# Altium schematic sheet board_schematic.SchDoc
size B
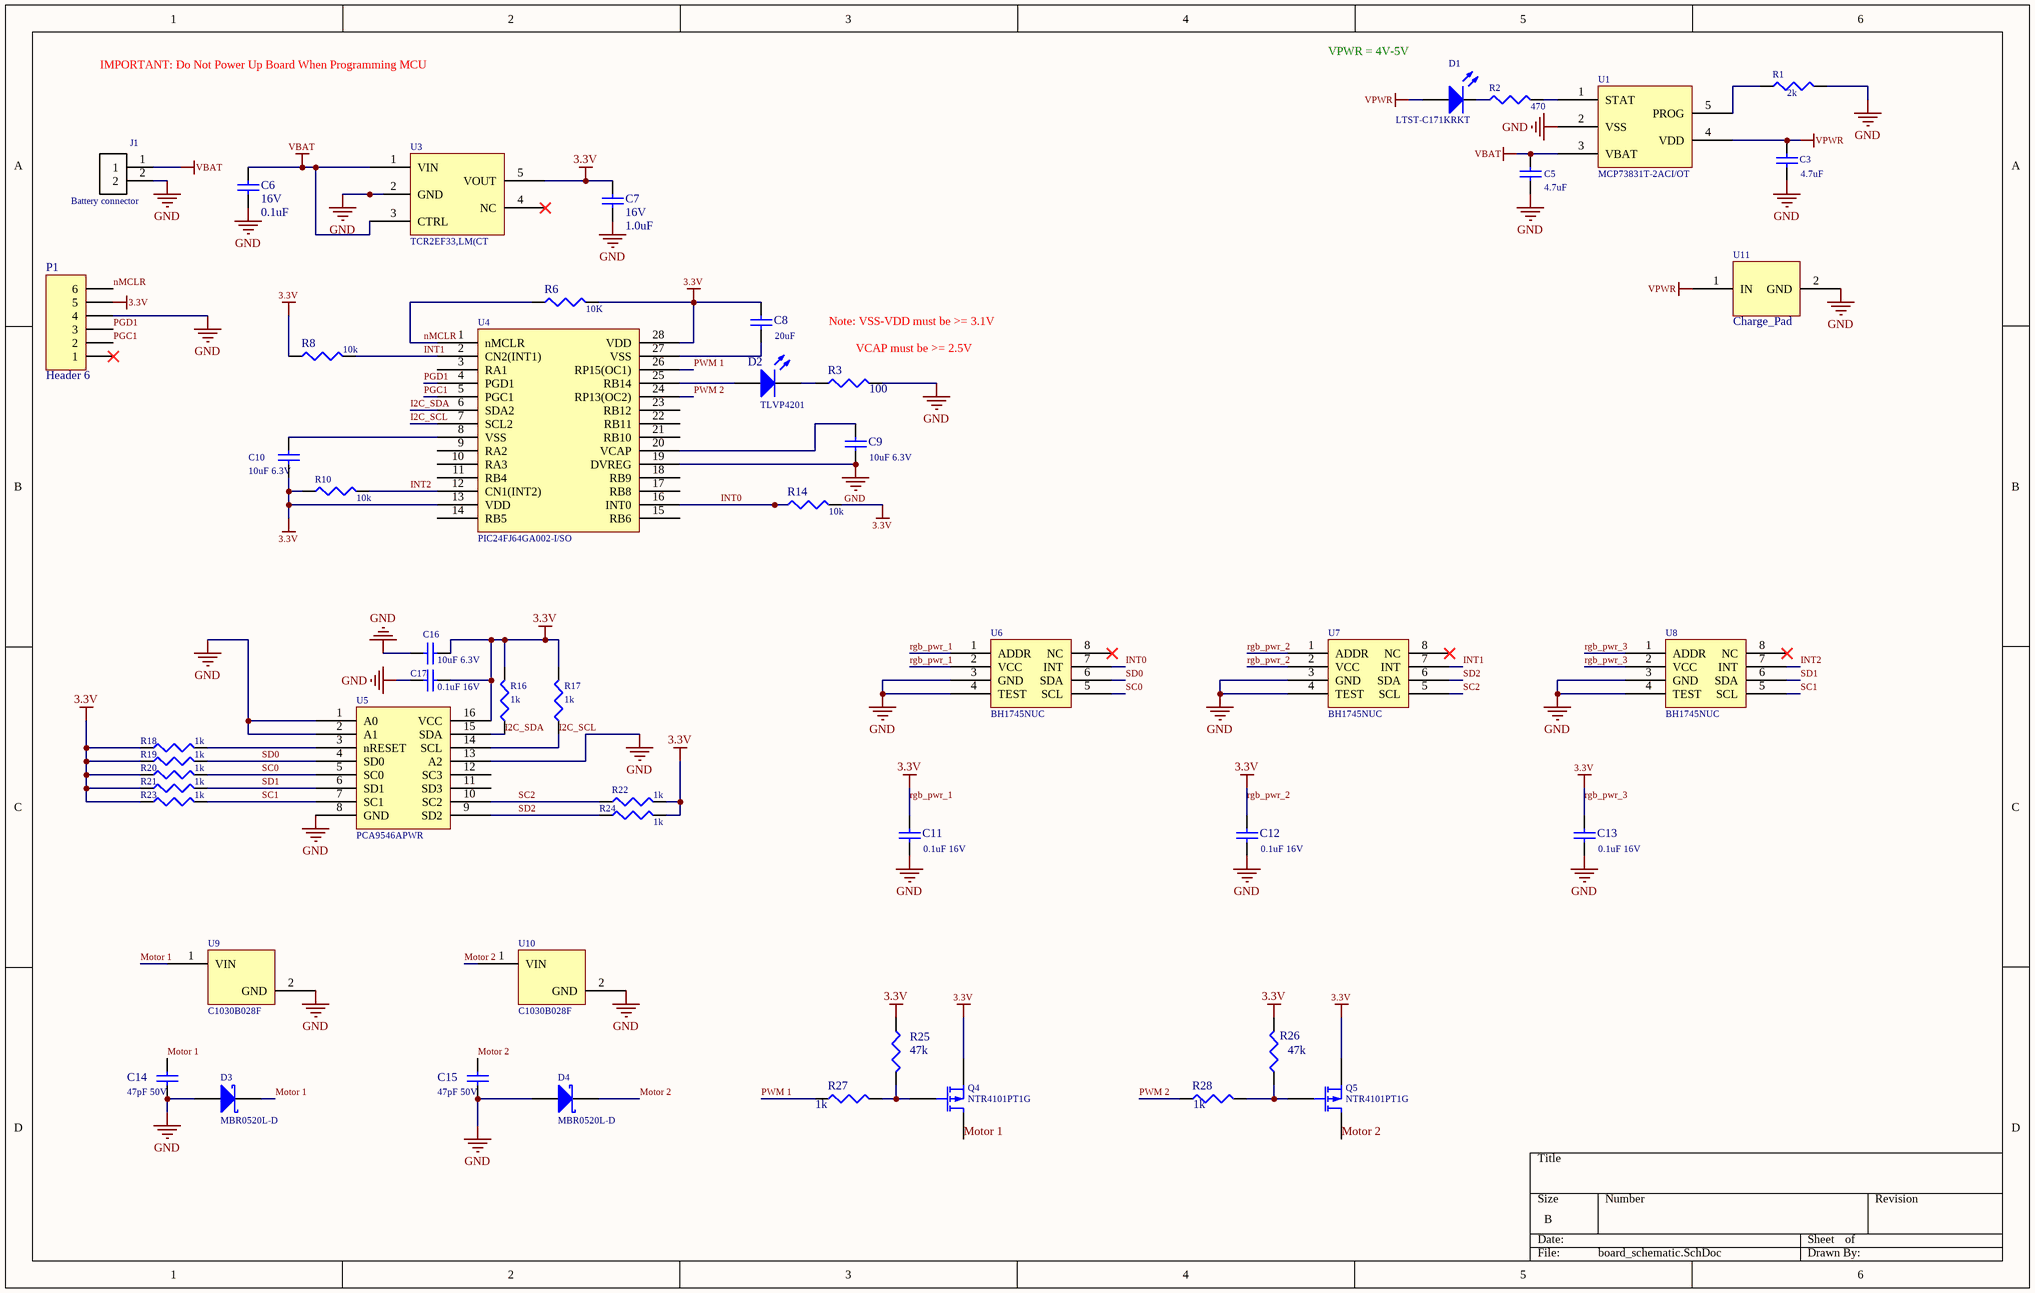
[diagram p0: board_schematic.SchDoc]

## Parts
C3  value 4.7uF  [1608[0603]]  (hidden comment: Cap Semi)
C5  value 4.7uF  [1608[0603]]  (hidden comment: Cap Semi)
C6  16V  value 0.1uF  [1608[0603]]
C7  16V  value 1.0uF  [1608[0603]]
C8  value 20uF  [1608[0603]]  (hidden comment: Cap Semi)
C9  value 10uF 6.3V  [1608[0603]]  (hidden comment: Cap Semi)
C10  value 10uF 6.3V  [1608[0603]]  (hidden comment: Cap Semi)
C11  value 0.1uF 16V  [1608[0603]]  (hidden comment: Cap Semi)
C12  value 0.1uF 16V  [1608[0603]]  (hidden comment: Cap Semi)
C13  value 0.1uF 16V  [1608[0603]]  (hidden comment: Cap Semi)
C14  value 47pF 50V  [1608[0603]]  (hidden comment: Cap Semi)
C15  value 47pF 50V  [1608[0603]]  (hidden comment: Cap Semi)
C16  value 10uF 6.3V  [1608[0603]]  (hidden comment: Cap Semi)
C17  value 0.1uF 16V  [1608[0603]]  (hidden comment: Cap Semi)
D1  LTST-C171KRKT  [LED_pcb]
D2  TLVP4201  [HDR1X2]
D3  MBR0520L-D  [SODFL375X128-2N]
D4  MBR0520L-D  [SODFL375X128-2N]
J1  Battery connector  [JST_S2B-PH-K-S(LF)(SN)]
P1  Header 6  [HDR1X6]
Q4  NTR4101PT1G  [SOT95P290X111-3N]
Q5  NTR4101PT1G  [SOT95P290X111-3N]
R1  value 2k  [J1-0603]  (hidden comment: Res3)
R2  value 470  [J1-0603]  (hidden comment: Res3)
R3  value 100  [J1-0603]  (hidden comment: Res3)
R6  value 10K  [J1-0603]  (hidden comment: Res3)
R8  value 10k  [J1-0603]  (hidden comment: Res3)
R10  value 10k  [J1-0603]  (hidden comment: Res3)
R14  value 10k  [J1-0603]  (hidden comment: Res3)
R16  1k  [J1-0603]
R17  1k  [J1-0603]
R18  1k  [J1-0603]
R19  1k  [J1-0603]
R20  1k  [J1-0603]
R21  value 1k  [J1-0603]  (hidden comment: Res3)
R22  value 1k  [J1-0603]  (hidden comment: Res3)
R23  value 1k  [J1-0603]  (hidden comment: Res3)
R24  value 1k  [J1-0603]  (hidden comment: Res3)
R25  value 47k  [J1-0603]  (hidden comment: Res3)
R26  value 47k  [J1-0603]  (hidden comment: Res3)
R27  value 1k  [J1-0603]  (hidden comment: Res3)
R28  value 1k  [J1-0603]  (hidden comment: Res3)
U1  MCP73831T-2ACI/OT  [SOT95P270X145-5N]
U3  TCR2EF33,LM(CT  [SOT95P275X111-5N]
U4  PIC24FJ64GA002-I/SO  [SOIC127P1030X265-28N]
U5  PCA9546APWR  [PCA9546APWR]
U6  BH1745NUC  [*UDFN-8]
U7  BH1745NUC  [*UDFN-8]
U8  BH1745NUC  [*UDFN-8]
U9  C1030B028F  [PCBComponent_1]
U10  C1030B028F  [PCBComponent_1]
U11  Charge_Pad  [charge_pad]

## Nets
GND: C3.1 C5.1 C6.1 C7.1 C9.1 C11.2 C12.1 C13.1 C14.1 C15.1 C16.1 C17.1 D3.1(A) D4.1(A) J1.2 P1.4 R1.2 R3.2 U1.2(VSS) U3.2(GND) U4.19(DVREG) U5.1(A0) U5.2(A1) U5.8(GND) U5.13(A2) U6.3(GND) U6.4(TEST) U7.3(GND) U7.4(TEST) U8.3(GND) U8.4(TEST) U9.2(GND) U10.2(GND) U11.2(GND)
rgb_pwr_1: C7.2 C8.2 C10.1 C11.1 C12.2 C13.2 C16.2 C17.2 P1.5 Q4.3(S) Q5.3(S) R6.2 R8.1 R10.1 R14.2 R16.2 R17.2 R18.1 R19.1 R20.1 R21.1 R22.2 R23.1 R24.2 R25.1 R26.2 U3.5(VOUT) U4.13(VDD) U4.28(VDD) U5.16(VCC) U6.1(ADDR) U6.2(VCC) U7.1(ADDR) U7.2(VCC) U8.1(ADDR) U8.2(VCC)  [also labelled 3.3V, rgb_pwr_2, rgb_pwr_3]
VBAT: C5.2 C6.2 J1.1 U1.3(VBAT) U3.1(VIN) U3.3(CTRL)
VPWR: C3.2 D1.1(A) U1.4(VDD) U11.1(IN)
I2C_SCL: R17.1 U4.7(SCL2) U5.14(SCL)
I2C_SDA: R16.1 U4.6(SDA2) U5.15(SDA)
INT0: R14.1 U4.16(INT0) U6.7(INT)
INT1: R8.2 U4.2(CN2(INT1)) U7.7(INT)
INT2: R10.2 U4.12(CN1(INT2)) U8.7(INT)
Motor 1: C14.2 D3.2(K) Q4.1(D) U9.1(VIN)
Motor 2: C15.2 D4.2(K) Q5.1(D) U10.1(VIN)
nMCLR: P1.6 R6.1 U4.1(nMCLR)
PGC1: P1.2 U4.5(PGC1)
PGD1: P1.3 U4.4(PGD1)
PWM 1: R27.1 U4.26(RP15(OC1))
PWM 2: R28.1 U4.24(RP13(OC2))
SC0: R20.2 U5.5(SC0) U6.5(SCL)
SC1: R23.2 U5.7(SC1) U8.5(SCL)
SC2: R22.1 U5.10(SC2) U7.5(SCL)
SD0: R19.2 U5.4(SD0) U6.6(SDA)
SD1: R21.2 U5.6(SD1) U8.6(SDA)
SD2: R24.1 U5.9(SD2) U7.6(SDA)
NetC8_1: C8.1 U4.27(VSS)
NetC9_2: C9.2 U4.20(VCAP)
NetC10_2: C10.2 U4.8(VSS)
NetD1_2: D1.2(K) R2.1
NetD2_1: D2.1(A) U4.25(RB14)
NetD2_2: D2.2(K) R3.1
NetQ4_2: Q4.2(G) R25.2 R27.2
NetQ5_2: Q5.2(G) R26.1 R28.2
NetR1_1: R1.1 U1.5(PROG)
NetR2_2: R2.2 U1.1(STAT)
NetR18_2: R18.2 U5.3(nRESET)

Not connected (* = marked no-connect by the designer): P1 1*; U3 4(NC)*; U4 3(RA1) 9(RA2) 10(RA3) 11(RB4) 14(RB5) 15(RB6) 17(RB8) 18(RB9) 21(RB10) 22(RB11) 23(RB12); U5 11(SD3) 12(SC3); U6 8(NC)*; U7 8(NC)*; U8 8(NC)*

## Notes on the sheet
- IMPORTANT: Do Not Power Up Board When Programming MCU
- VPWR = 4V-5V
- Note: VSS-VDD must be >= 3.1V
- (near R3) VCAP must be >= 2.5V

## Library data of the parts
C3 C5-C17 = Cap Semi: Capacitor (Semiconductor SIM Model); Published: 8-Jun-2000; LatestRevisionDate: 29-May-2009; LatestRevisionNote: IPC-7351 Footprint Added.; PackageReference: C1206; Publisher: Altium Limited; PackageDescription: Chip Capacitor
D1 = LED2: Typical RED, GREEN, YELLOW, AMBER GaAs LED; Published: 8-Jun-2000; LatestRevisionDate: 17-Jul-2002; LatestRevisionNote: Re-released for DXP Platform.; PackageVersion: Feb-2002; PackageReference: 3.2X1.6X1.1; Publisher: Altium Limited; PackageDescription: SM LED; 2 Flat Leads
D2 = LED0: Typical INFRARED GaAs LED; Published: 8-Jun-2000; LatestRevisionDate: 08-Jul-2005; LatestRevisionNote: Mech Layer 1 removed.; PackageReference: LED-0; Publisher: Altium Limited; PackageDescription: LED; 2 Leads
D3 D4 = D Schottky: Schottky Diode; Published: 8-Jun-2000; LatestRevisionDate: 17-Jul-2002; LatestRevisionNote: Re-released for DXP Platform.; PackageReference: SMB; Publisher: Altium Limited; PackageDescription: DO-214-AA/SMB; 2 C-Bend Leads; Body 5.3 x 3.6 mm, inc. leads (LxW); Code_JEDEC: DO-214-AA
J1 = S2B-PH-K-S(LF)(SN): PH Series 2 Position 2.0 mm Through Hole Side Entry Shrouded Header; MP: S2B-PH-K-S_LF__SN_; MF: JST Sales; Package: None; Digi-Key_Purchase_URL: https://www.digikey.com/product-detail/en/jst-sales-america-inc/S2B-PH-K-S_LF__SN_/455-1719-ND/926626?utm_source=snapeda&utm_medium=aggregator&utm_campaign=symbol; Digi-Key_Part_Number: 455-1719-ND; SnapEDA_Link: https://www.snapeda.com/parts/S2B-PH-K-S%28LF%29%28SN%29/JST%20Sales%20America%20Inc./view-part/?ref=snap; Value: *
P1 = Header 6: Header, 6-Pin; LatestRevisionDate: 17-Jul-2002; LatestRevisionNote: Re-released for DXP Platform.; Publisher: Altium Limited
Q4 Q5 = MOSFET-P: P-Channel MOSFET; Published: 8-Jun-2000; LatestRevisionDate: 17-Jul-2002; LatestRevisionNote: Re-released for DXP Platform.; PackageVersion: 1995/1996; PackageReference: E3; Publisher: Altium Limited; PackageDescription: TO, Flat Index; 3 In-Line, Axial Leads; Body Dia. 4.6mm; Lead Dia. 0.5 mm (max)
R1-R3 R6 R8 R10 R14 R16-R28 = Res3: Resistor; Published: 8-Jun-2000; LatestRevisionDate: 29-May-2009; LatestRevisionNote: IPC-7351 Footprint Added.; PackageReference: J1-0603; Publisher: Altium Limited; PackageDescription: Chip Resistor
  R16-R20: Value: 1K
U1 U3-U11 = Component_1